# EAGLE design cpldtestbrd (EAGLE 5.07)
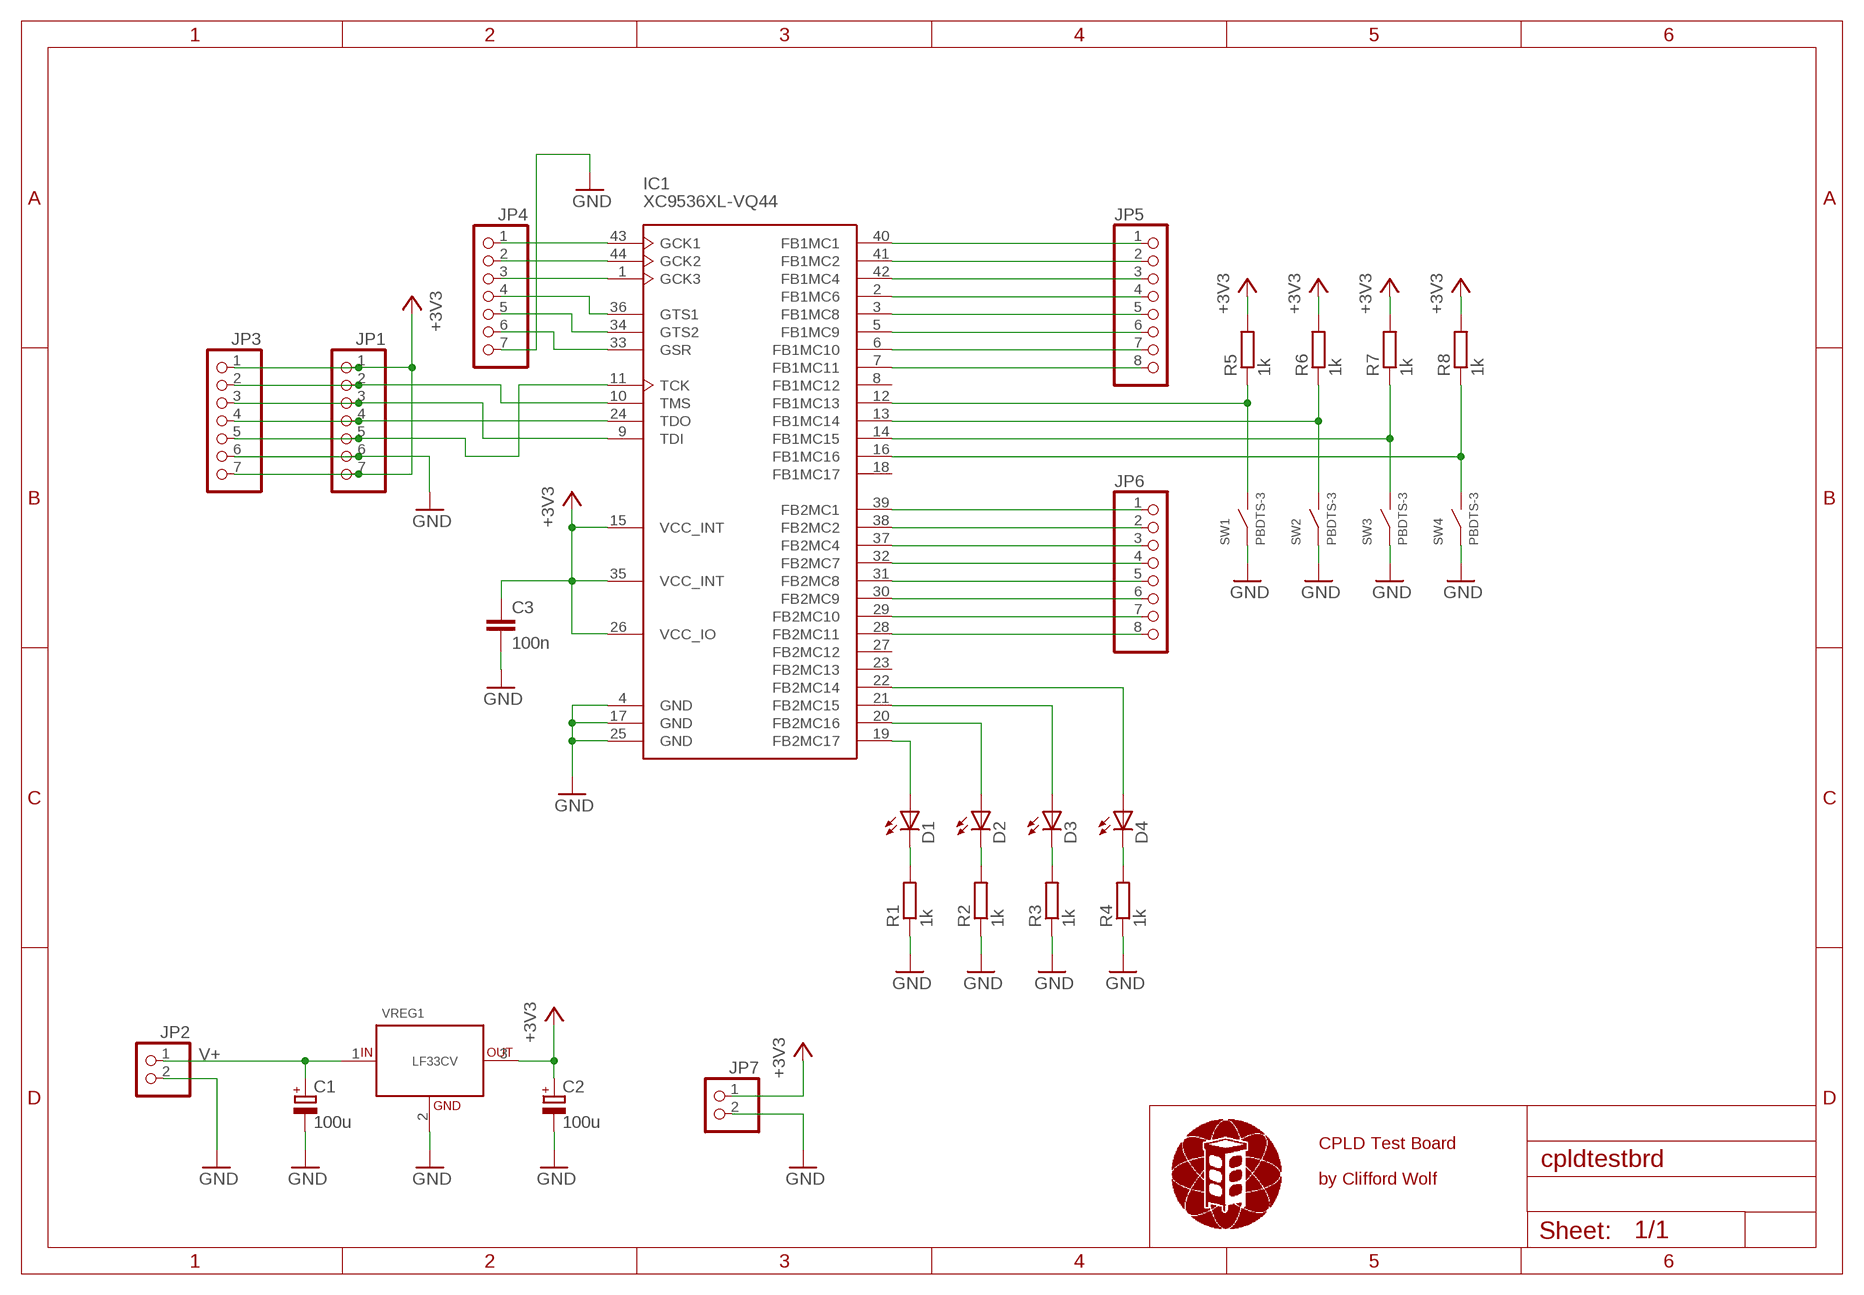
[diagram p0: schematic, sheet 1]

## Parts
C1  100u  CPOLE5-10,5L  [E5-10,5L]
C2  100u  CPOLE5-10,5L  [E5-10,5L]
C3  100n  C050-030X075  [C050-030X075]
D1  LED5MM  [LED5MM]
D2  LED5MM  [LED5MM]
D3  LED5MM  [LED5MM]
D4  LED5MM  [LED5MM]
IC1  XC9536XL-VQ44  [TQFP44]
JP1  PINHD-1X7  [1X07]
JP2  PINHD-1X2  [1X02]
JP3  PINHD-1X7  [1X07]
JP4  PINHD-1X7  [1X07]
JP5  PINHD-1X8  [1X08]
JP6  PINHD-1X8  [1X08]
JP7  PINHD-1X2  [1X02]
R1  1k  R0309/10  [0309/10]
R2  1k  R0309/10  [0309/10]
R3  1k  R0309/10  [0309/10]
R4  1k  R0309/10  [0309/10]
R5  1k  R0309/10  [0309/10]
R6  1k  R0309/10  [0309/10]
R7  1k  R0309/10  [0309/10]
R8  1k  R0309/10  [0309/10]
SW1  PBDTS-3  [DTS-3]
SW2  PBDTS-3  [DTS-3]
SW3  PBDTS-3  [DTS-3]
SW4  PBDTS-3  [DTS-3]
VREG1  LF33CV  [TO220]

## Nets
+3V3 [pwr]: C2.+ C3.1 IC1.15(VCC_INT) IC1.26(VCC_IO) IC1.35(VCC_INT) JP1.1 JP1.7 JP3.1 JP3.7 JP7.1 R5.2 R6.2 R7.2 R8.2 VREG1.3(OUT)
GND [pwr]: C1.- C2.- C3.2 IC1.4(GND) IC1.17(GND) IC1.25(GND) JP1.6 JP2.2 JP3.6 JP4.7 JP7.2 R1.1 R2.1 R3.1 R4.1 SW1.P$1 SW2.P$1 SW3.P$1 SW4.P$1 VREG1.2(GND)
N$1: IC1.10(TMS) JP1.2 JP3.2
N$2: IC1.9(TDI) JP1.3 JP3.3
N$3: IC1.24(TDO) JP1.4 JP3.4
N$4: IC1.11(TCK) JP1.5 JP3.5
N$6: IC1.39(FB2MC1) JP6.1
N$7: IC1.43(GCK1) JP4.1
N$8: IC1.44(GCK2) JP4.2
N$9: IC1.1(GCK3) JP4.3
N$10: IC1.36(GTS1) JP4.4
N$11: IC1.34(GTS2) JP4.5
N$12: IC1.33(GSR) JP4.6
N$13: IC1.38(FB2MC2) JP6.2
N$14: IC1.40(FB1MC1) JP5.1
N$15: IC1.41(FB1MC2) JP5.2
N$16: IC1.42(FB1MC4) JP5.3
N$17: IC1.2(FB1MC6) JP5.4
N$18: IC1.3(FB1MC8) JP5.5
N$19: IC1.5(FB1MC9) JP5.6
N$20: IC1.6(FB1MC10) JP5.7
N$21: IC1.7(FB1MC11) JP5.8
N$22: IC1.37(FB2MC4) JP6.3
N$23: IC1.32(FB2MC7) JP6.4
N$24: IC1.31(FB2MC8) JP6.5
N$25: IC1.30(FB2MC9) JP6.6
N$26: IC1.29(FB2MC10) JP6.7
N$27: IC1.28(FB2MC11) JP6.8
N$28: D1.A IC1.19(FB2MC17)
N$29: D2.A IC1.20(FB2MC16)
N$30: D3.A IC1.21(FB2MC15)
N$31: D4.A IC1.22(FB2MC14)
N$32: D1.K(C) R1.2
N$33: D2.K(C) R2.2
N$34: D3.K(C) R3.2
N$35: D4.K(C) R4.2
N$36: IC1.12(FB1MC13) R5.1 SW1.P$2
N$37: IC1.13(FB1MC14) R6.1 SW2.P$2
N$38: IC1.14(FB1MC15) R7.1 SW3.P$2
N$39: IC1.16(FB1MC16) R8.1 SW4.P$2
V+ [pwr]: C1.+ JP2.1 VREG1.1(IN)
Unconnected: IC1.8(FB1MC12) IC1.18(FB1MC17) IC1.23(FB2MC13) IC1.27(FB2MC12)

## Notes on the sheet
- CPLD Test Board
- by Clifford Wolf

## Library data of the parts
C1 C2 = mp_passive:CPOL: POLARIZED CAPACITOR, European symbol
C3 = mp_passive:C: CAPACITOR, European symbol
D1-D4 = mp_diode:LED: LED (5mm)
IC1 = mp_prog:XC9536XL-VQ44: Xilinx CPLD XC9536XL, TQFP44 For more information, please visit the online repository at: http://viewvc.coremelt.net/viewvc/eagle/libraries
JP1 JP3 JP4 = mpc_pinhead:PINHD-1X7: PIN HEADER
JP2 JP7 = mpc_pinhead:PINHD-1X2: PIN HEADER
JP5 JP6 = mpc_pinhead:PINHD-1X8: PIN HEADER
R1-R8 = mp_passive:R: RESISTOR, European symbol
SW1-SW4 = mp_switch:PB: Push-Button
VREG1 = mp_vreg:LF33CV: LF33CV Low Drop 3.3V Voltage Regulator

## Net classes
1 pwr: width 0.508 mm

## Board
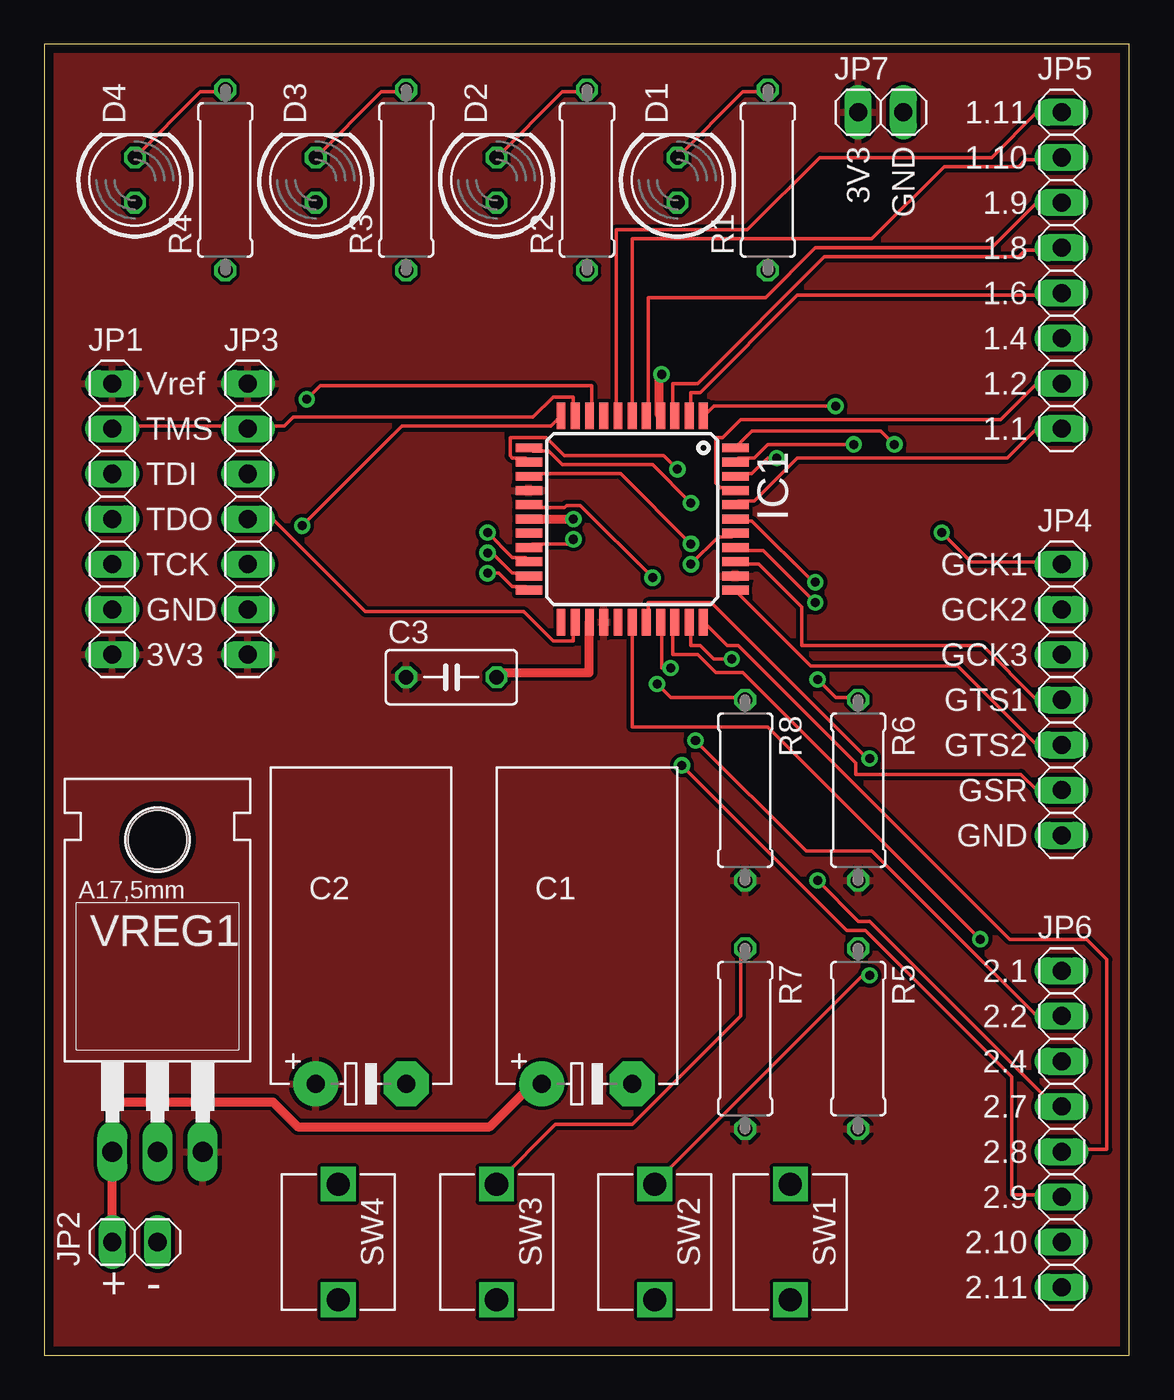
[diagram p1: board, top side]
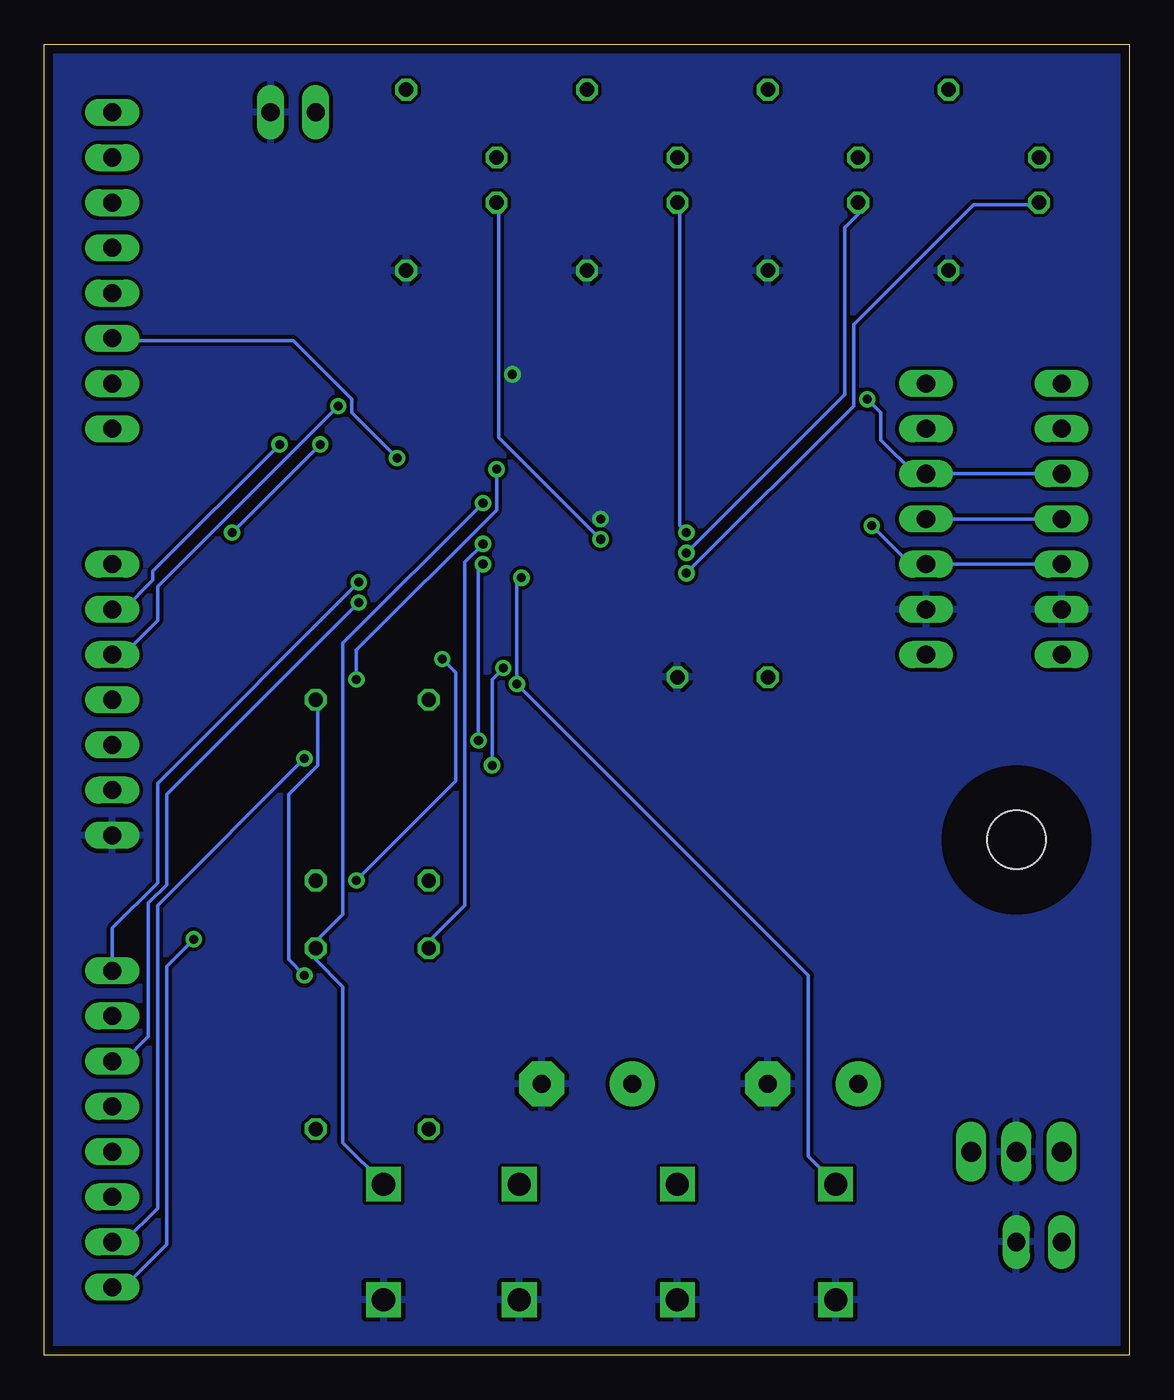
[diagram p2: board, bottom side, seen from below]

Size 60.96 x 73.66 mm. Coordinates in mm from the lower left corner, seen from the top.
Outline: 0,0 60.96,0 60.96,73.66 0,73.66 0,0
Copper layers (1*16): Top 0.035mm / dielectric 1.5mm / Bottom 0.035mm
Design rules "qp_designrules_8mil": minimum track width 8mil, minimum drill 20mil, track to track 8mil, track to pad 8mil, pad to pad 8mil, via to via 8mil, smd to smd 8mil, copper to edge 20mil, drill to drill 20mil, minimum pad ring 8mil, minimum via ring 8mil, stop-mask expansion 0mil, vias tented up to drill 0mil, thermal gap 10mil
vRestrict: area 50.8,50.8 to 55.9,71.1; area 49.5,27.9 to 55.9,45.7; area 50.8,2.5 to 55.9,22.9; area 2.5,2.5 to 7.6,5.1; area 5.1,38.1 to 10.2,55.9; area 25.4,40.6 to 29.2,53.3; area 36.8,40.6 to 40.6,53.3; area 27.9,50.8 to 38.1,54.6; area 27.9,39.4 to 38.1,43.2; area 0,15.2 to 12.7,34.3

### Footprints (pad centres in the part's own frame; a part is rotated, then mirrored left to right if it is on the bottom)
E5-10,5L = drill 1.016 pad 2.54 round: + -2.54,0 | drill 1.016 pad 2.54 octagon: - 2.54,0
C050-030X075 = drill 0.813 octagon: 1 -2.54,0; 2 2.54,0
LED5MM = drill 0.813 octagon: A -1.27,0; K 1.27,0
TQFP44 = smd 1.5 x 0.5: 1 -0.72,9.08; 2 -0.72,8.28; 3 -0.72,7.48; 4 -0.72,6.68; 5 -0.72,5.88; 6 -0.72,5.08; 7 -0.72,4.28; 8 -0.72,3.48; 9 -0.72,2.68; 10 -0.72,1.88; 11 -0.72,1.08; 23 10.88,1.08; 24 10.88,1.88; 25 10.88,2.68; 26 10.88,3.48; 27 10.88,4.28; 28 10.88,5.08; 29 10.88,5.88; 30 10.88,6.68; 31 10.88,7.48; 32 10.88,8.28; 33 10.88,9.08 | smd 0.5 x 1.5: 12 1.08,-0.72; 13 1.88,-0.72; 14 2.68,-0.72; 15 3.48,-0.72; 16 4.28,-0.72; 17 5.08,-0.72; 18 5.88,-0.72; 19 6.68,-0.72; 20 7.48,-0.72; 21 8.28,-0.72; 22 9.08,-0.72; 34 9.08,10.88; 35 8.28,10.88; 36 7.48,10.88; 37 6.68,10.88; 38 5.88,10.88; 39 5.08,10.88; 40 4.28,10.88; 41 3.48,10.88; 42 2.68,10.88; 43 1.88,10.88; 44 1.08,10.88
1X07 = drill 1.016 long: 1 -7.62,0; 2 -5.08,0; 3 -2.54,0; 4 0,0; 5 2.54,0; 6 5.08,0; 7 7.62,0
1X02 = drill 1.016 long: 1 -1.27,0; 2 1.27,0
1X08 = drill 1.016 long: 1 -8.89,0; 2 -6.35,0; 3 -3.81,0; 4 -1.27,0; 5 1.27,0; 6 3.81,0; 7 6.35,0; 8 8.89,0
0309/10 = drill 0.813 octagon: 1 -5.08,0; 2 5.08,0
DTS-3 = drill 1.3 square: P$1 3.25,0; P$2 -3.25,0
TO220 = drill 1.118 long: 1 -2.54,-6.35; 2 0,-6.35; 3 2.54,-6.35 | hole 3.302: 0,11.176

### Placement (x,y rotation side)
C1  30.48,15.24 0 top
C2  17.78,15.24 0 top
C3  22.86,38.1 0 top
D1  35.56,66.04 90 top
D2  25.4,66.04 90 top
D3  15.24,66.04 90 top
D4  5.08,66.04 90 top
IC1  27.94,52.07 270 top
JP1  3.81,46.99 270 top
JP2  5.08,6.35 0 top
JP3  11.43,46.99 270 top
JP4  57.15,36.83 270 top
JP5  57.15,60.96 90 top
JP6  57.15,12.7 270 top
JP7  46.99,69.85 0 top
R1  40.64,66.04 90 top
R2  30.48,66.04 90 top
R3  20.32,66.04 90 top
R4  10.16,66.04 90 top
R5  45.72,17.78 270 top
R6  45.72,31.75 270 top
R7  39.37,17.78 270 top
R8  39.37,31.75 270 top
SW1  41.91,6.35 270 top
SW2  34.29,6.35 270 top
SW3  25.4,6.35 270 top
SW4  16.51,6.35 270 top
VREG1  6.35,17.78 0 top

### Tracks (layer width: path | path; a pad name or v marks a point on that pad's centre or on a via)
+3V3
  pour Top: 0,73.66 60.96,73.66 60.96,0 0,0
GND  (via drill 0.51)
  Top 0.508: C3.2 25.53,38.1 25.78,38.35 30.61,38.35 30.61,41.15 IC1.25 | IC1.17 v29.72,46.99 | v34.67,55.12 34.54,55.12 34.54,52.83 IC1.4
  pour Bottom: 0,73.66 60.96,73.66 60.96,0 0,0
N$1
  Top 0.203: IC1.10 29.72,52.83 29.72,53.85 28.57,53.85 27.43,52.7 13.97,52.7 13.46,52.2 11.56,52.2 JP3.2 11.43,52.2 3.94,52.2 JP1.2
N$2  (via drill 0.51)
  Top 0.203: v14.73,53.72 15.49,54.48 30.73,54.48 30.73,52.83 IC1.9
  Bottom 0.203: v14.73,53.72 13.97,52.96 13.97,51.44 12.06,49.53 JP3.3 JP1.3
N$3
  Top 0.203: JP3.4 12.83,46.99 18.03,41.78 26.92,41.78 28.57,40.13 29.72,40.13 29.72,41.15 IC1.24
  Bottom 0.203: JP1.4 JP3.4
N$4  (via drill 0.51)
  Top 0.203: v14.48,46.61 20.07,52.2 28.45,52.2 28.96,52.7 IC1.11
  Bottom 0.203: v14.48,46.61 12.32,44.45 JP3.5 JP1.5
N$6  (via drill 0.51)
  Top 0.203: v43.31,43.43 43.18,43.43 39.75,46.86 38.99,46.86 38.86,46.99 IC1.39
  Bottom 0.203: v43.31,43.43 54.61,32.13 54.61,26.54 57.15,24 JP6.1
N$7  (via drill 0.51)
  Top 0.203: v45.47,51.18 40.64,51.18 39.88,50.42 38.99,50.42 38.86,50.29 IC1.43 | v50.42,46.23 52.07,44.58 57.02,44.58 JP4.1
  Bottom 0.203: v45.47,51.18 v50.42,46.23
N$8  (via drill 0.51)
  Top 0.203: v47.75,51.18 46.99,51.94 39.75,51.94 38.86,51.05 IC1.44
  Bottom 0.203: v47.75,51.18 54.86,44.07 54.86,43.56 56.52,41.91 JP4.2
N$9  (via drill 0.51)
  Top 0.203: v44.45,53.34 37.59,53.34 37.08,52.83 IC1.1
  Bottom 0.203: v44.45,53.34 54.61,43.18 54.61,41.27 56.52,39.37 JP4.3
N$10
  Top 0.203: JP4.4 55.75,36.83 52.7,39.88 42.55,39.88 42.55,42.04 40.13,44.45 38.99,44.45 38.86,44.58 IC1.36
N$11
  Top 0.203: JP4.5 55.75,34.29 51.31,38.73 43.05,38.73 38.86,42.93 IC1.34
N$12
  Top 0.203: JP4.6 55.75,31.75 54.86,32.64 45.59,32.64 45.59,33.27 38.99,39.88 38.35,39.88 37.08,41.15 IC1.33
N$13  (via drill 0.51)
  Top 0.203: v36.32,44.45 37.85,45.97 38.61,45.97 38.73,46.1 IC1.38 | v36.58,34.54 42.8,28.32 46.48,28.32 55.75,19.05 JP6.2
  Bottom 0.203: v36.32,44.45 36.58,44.2 v36.58,34.54
N$14
  Top 0.203: JP5.1 55.75,52.07 54.1,50.42 42.29,50.42 39.88,48.01 38.99,48.01 38.86,47.88 IC1.40
N$15
  Top 0.203: JP5.2 55.75,54.61 53.72,52.58 39.12,52.58 38.1,51.56 37.72,51.56 37.72,49.02 37.97,48.77 38.61,48.77 38.73,48.64 IC1.41
N$16  (via drill 0.51)
  Top 0.203: v41.15,50.42 40.64,50.42 39.75,49.53 38.99,49.53 38.86,49.4 IC1.42
  Bottom 0.203: v41.15,50.42 43.69,52.96 43.69,53.72 46.99,57.02 57.15,57.02 JP5.3
N$17
  Top 0.203: JP5.4 57.02,59.56 42.29,59.56 36.83,54.1 36.32,54.1 36.32,52.83 IC1.2
N$18
  Top 0.203: JP5.5 57.02,62.1 55.12,62.1 54.74,61.72 43.81,61.72 36.7,54.61 35.31,54.61 35.31,52.83 IC1.3
N$19
  Top 0.203: JP5.6 55.75,64.77 53.21,62.23 43.31,62.23 40.51,59.44 33.91,59.44 33.91,52.83 IC1.5
N$20
  Top 0.203: JP5.7 57.02,67.18 55.12,67.18 54.74,66.8 50.55,66.8 46.48,62.74 33.02,62.74 IC1.6
N$21
  Top 0.203: JP5.8 55.75,69.85 53.21,67.31 43.56,67.31 39.5,63.25 32.13,63.25 32.13,52.83 IC1.7
N$22  (via drill 0.51)
  Top 0.203: v43.31,42.29 40.39,45.21 38.99,45.21 38.86,45.34 IC1.37
  Bottom 0.203: v43.31,42.29 54.1,31.5 54.1,26.42 55.12,25.4 55.12,17.91 56.52,16.51 JP6.3
N$23  (via drill 0.51)
  Top 0.203: v38.61,39.12 37.59,39.12 36.83,39.88 36.32,39.88 36.32,41.15 IC1.32 | v43.43,26.67 45.72,24.38 46.35,24.38 56.77,13.97 JP6.4
  Bottom 0.203: v38.61,39.12 37.85,38.35 37.85,32.26 v43.43,26.67
N$24
  Top 0.203: JP6.5 57.28,11.56 59.69,11.56 59.69,22.23 58.55,23.37 54.23,23.37 39.24,38.35 37.72,38.35 36.7,39.37 35.31,39.37 35.31,41.15 IC1.31
N$25  (via drill 0.51)
  Top 0.203: v35.18,38.61 34.67,38.61 34.67,41.15 IC1.30 | v35.81,33.15 45.09,23.88 46.1,23.88 54.36,15.62 54.36,9.02 57.02,9.02 JP6.6
  Bottom 0.203: v35.18,38.61 35.81,37.97 v35.81,33.15
N$26  (via drill 0.51)
  Top 0.203: v46.35,33.53 46.23,33.53 37.47,42.29 33.91,42.29 33.91,41.27 IC1.29
  Bottom 0.203: v46.35,33.53 54.61,25.27 54.61,8.26 56.52,6.35 JP6.7
N$27  (via drill 0.51)
  Top 0.203: v52.58,23.37 40.64,35.31 33.02,35.31 IC1.28
  Bottom 0.203: v52.58,23.37 54.1,21.84 54.1,6.22 56.52,3.81 JP6.8
N$28  (via drill 0.51)
  Top 0.203: v29.72,45.85 29.46,45.59 27.43,45.59 27.3,45.47 IC1.19
  Bottom 0.203: v29.72,45.85 35.43,51.56 35.43,64.64 D1.A
N$29  (via drill 0.51)
  Top 0.203: v24.89,46.23 26.29,44.83 27.05,44.83 27.18,44.7 IC1.20
  Bottom 0.203: v24.89,46.23 25.27,46.61 25.27,64.64 D2.A
N$30  (via drill 0.51)
  Top 0.203: v24.89,45.09 25.15,45.09 26.29,43.94 27.05,43.94 27.18,43.81 IC1.21
  Bottom 0.203: v24.89,45.09 16,53.98 16,63.37 15.24,64.14 D3.A
N$31  (via drill 0.51)
  Top 0.203: v24.89,43.94 25.53,43.94 26.29,43.18 27.05,43.18 27.18,43.05 IC1.22
  Bottom 0.203: v24.89,43.94 15.49,53.34 15.49,57.91 8.76,64.64 5.08,64.64 D4.A
N$32
  Top 0.203: D1.K 39.24,70.99 40.51,70.99 R1.2
N$33
  Top 0.203: D2.K 29.08,70.99 30.35,70.99 R2.2
N$34
  Top 0.203: D3.K 18.92,70.99 20.19,70.99 R3.2
N$35
  Top 0.203: D4.K 8.76,70.99 10.03,70.99 R4.2
N$36  (via drill 0.51)
  Top 0.203: v36.32,47.88 34.16,50.04 29.08,50.04 28.32,50.8 27.43,50.8 27.3,50.93 IC1.12
  Bottom 0.203: v36.32,47.88 44.2,40.01 44.2,24.77 45.72,23.24 R5.1 45.72,22.23 44.2,20.7 44.2,11.94 41.91,9.65 SW1.P$2
N$37  (via drill 0.51)
  Top 0.203: v35.56,49.78 34.8,50.55 29.21,50.55 28.19,51.56 26.16,51.56 26.16,50.55 26.29,50.42 27.05,50.42 27.18,50.29 IC1.13 | v43.43,37.97 44.45,36.96 45.59,36.96 R6.1 | v46.35,21.34 45.97,21.34 34.29,9.65 SW2.P$2
  Bottom 0.203: v35.56,49.78 35.56,47.5 43.43,39.62 v43.43,37.97 | v46.35,21.34 47.24,22.23 47.24,31.5 45.59,33.15 45.59,36.7 R6.1
N$38  (via drill 0.51)
  Top 0.203: v36.32,45.59 32.38,49.53 27.43,49.53 27.3,49.4 IC1.14 | R7.1 39.12,22.86 39.12,19.05 33.02,12.95 28.7,12.95 25.4,9.65 SW3.P$2
  Bottom 0.203: v36.32,45.59 37.34,44.58 37.34,25.27 39.37,23.24 R7.1
N$39  (via drill 0.51)
  Top 0.203: v34.16,43.69 30.1,47.75 29.34,47.75 29.21,47.62 27.43,47.62 27.3,47.75 IC1.16 | v34.42,37.72 35.18,36.96 39.24,36.96 R8.1
  Bottom 0.203: v34.16,43.69 34.42,43.43 v34.42,37.72 18.03,21.34 18.03,11.18 16.51,9.65 SW4.P$2
V+
  Top 0.508: JP2.1 VREG1.1 3.81,14.22 12.83,14.22 14.22,12.83 25.02,12.83 27.43,15.24 C1.+

### Text on the board
tPlace: 1.11 | 3V3 | GND | 1.10 | 1.9 | 1.8 | 1.6 | 1.4 | 1.2 | Vref | 1.1 | TMS | TDI | TDO | GCK1 | TCK | GCK2 | GND | GCK3 | 3V3 | GTS1 | GTS2 | GSR | GND | 2.1 | 2.2 | 2.4 | 2.7 | 2.8 | 2.9 | 2.10 | 2.11 | + | -